# Altium project bme_affect_sen_brd.PrjPcb
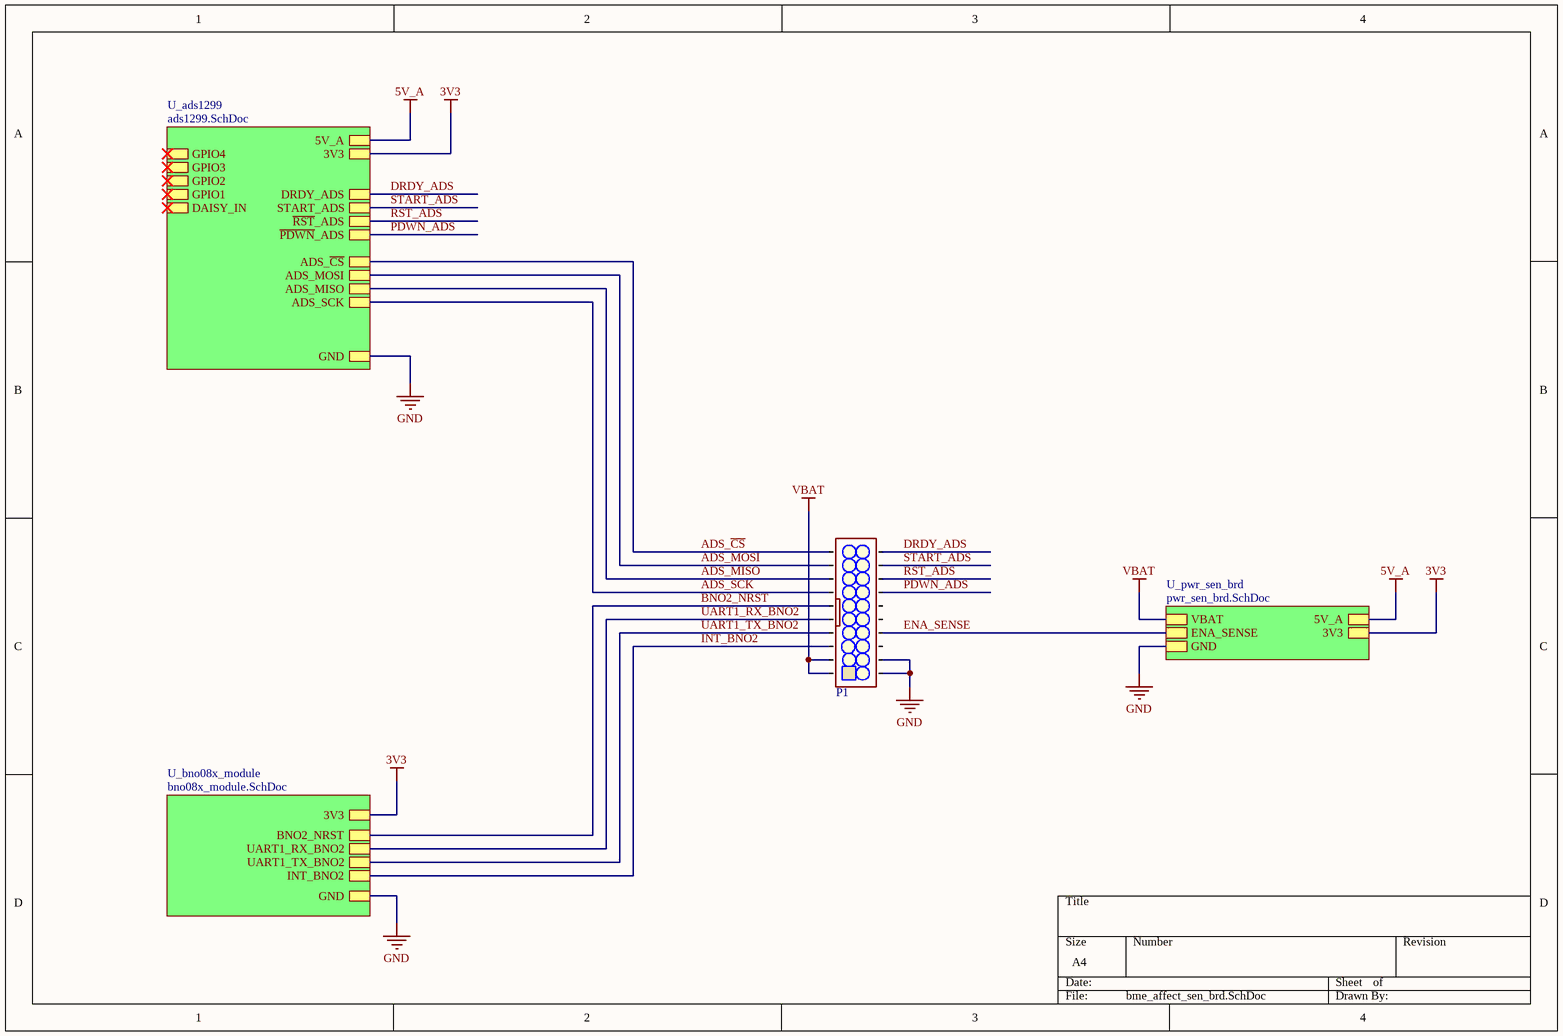
[diagram p0: bme_affect_sen_brd.SchDoc]
4 sheets, 139 parts. Net scope: hierarchical (ports join the sheet entries above them; power ports are global).
Board file: bme_affect_sen_brd.PcbDoc
Sheets:
  bme_affect_sen_brd.SchDoc
    U_ads1299 = ads1299.SchDoc
    U_pwr_sen_brd = pwr_sen_brd.SchDoc
    U_bno08x_module = bno08x_module.SchDoc

## Sheet bme_affect_sen_brd.SchDoc
size A4

### Parts
P1  2x10 Ribbon Header  [2x10_RIBBON_CABLE_CON]  (value not drawn)

### Sub-sheets
U_ads1299 = ads1299.SchDoc: DRDY_ADS, GPIO4, GPIO2, GPIO3, START_ADS, GPIO1, DAISY_IN, 3V3, 5V_A, GND, ~{RST}_ADS, ~{PDWN}_ADS, ADS_~{CS}, ADS_MOSI, ADS_MISO, ADS_SCK
U_bno08x_module = bno08x_module.SchDoc: 3V3, GND, BNO2_NRST, UART1_RX_BNO2, UART1_TX_BNO2, INT_BNO2
U_pwr_sen_brd = pwr_sen_brd.SchDoc: 5V_A, VBAT, GND, 3V3, ENA_SENSE

### Nets
3V3: sheet U_ads1299/3V3, sheet U_pwr_sen_brd/3V3, sheet U_bno08x_module/3V3
5V_A: sheet U_ads1299/5V_A, sheet U_pwr_sen_brd/5V_A
GND: P1.19 P1.20 ; sheet U_ads1299/GND, sheet U_pwr_sen_brd/GND, sheet U_bno08x_module/GND
VBAT: P1.1 P1.2 ; sheet U_pwr_sen_brd/VBAT
ADS_~{CS}: P1.10 ; sheet U_ads1299/ADS_~{CS}
ADS_MISO: P1.8 ; sheet U_ads1299/ADS_MISO
ADS_MOSI: P1.9 ; sheet U_ads1299/ADS_MOSI
ADS_SCK: P1.7 ; sheet U_ads1299/ADS_SCK
BNO2_NRST: P1.6 ; sheet U_bno08x_module/BNO2_NRST
DRDY_ADS: P1.11 ; sheet U_ads1299/DRDY_ADS
ENA_SENSE: P1.17 ; sheet U_pwr_sen_brd/ENA_SENSE
INT_BNO2: P1.3 ; sheet U_bno08x_module/INT_BNO2
~{PDWN}_ADS: P1.14 ; sheet U_ads1299/~{PDWN}_ADS
~{RST}_ADS: P1.13 ; sheet U_ads1299/~{RST}_ADS
START_ADS: P1.12 ; sheet U_ads1299/START_ADS
UART1_RX_BNO2: P1.5 ; sheet U_bno08x_module/UART1_RX_BNO2
UART1_TX_BNO2: P1.4 ; sheet U_bno08x_module/UART1_TX_BNO2

Not connected (* = marked no-connect by the designer): P1 15 16 18

### Library data of the parts
P1 = 2x10 Ribbon Header: 2.54 mm; Manufacturer Part No: 302-S201; Value: 2x10 Pin Header

## Sheet ads1299.SchDoc
size A3
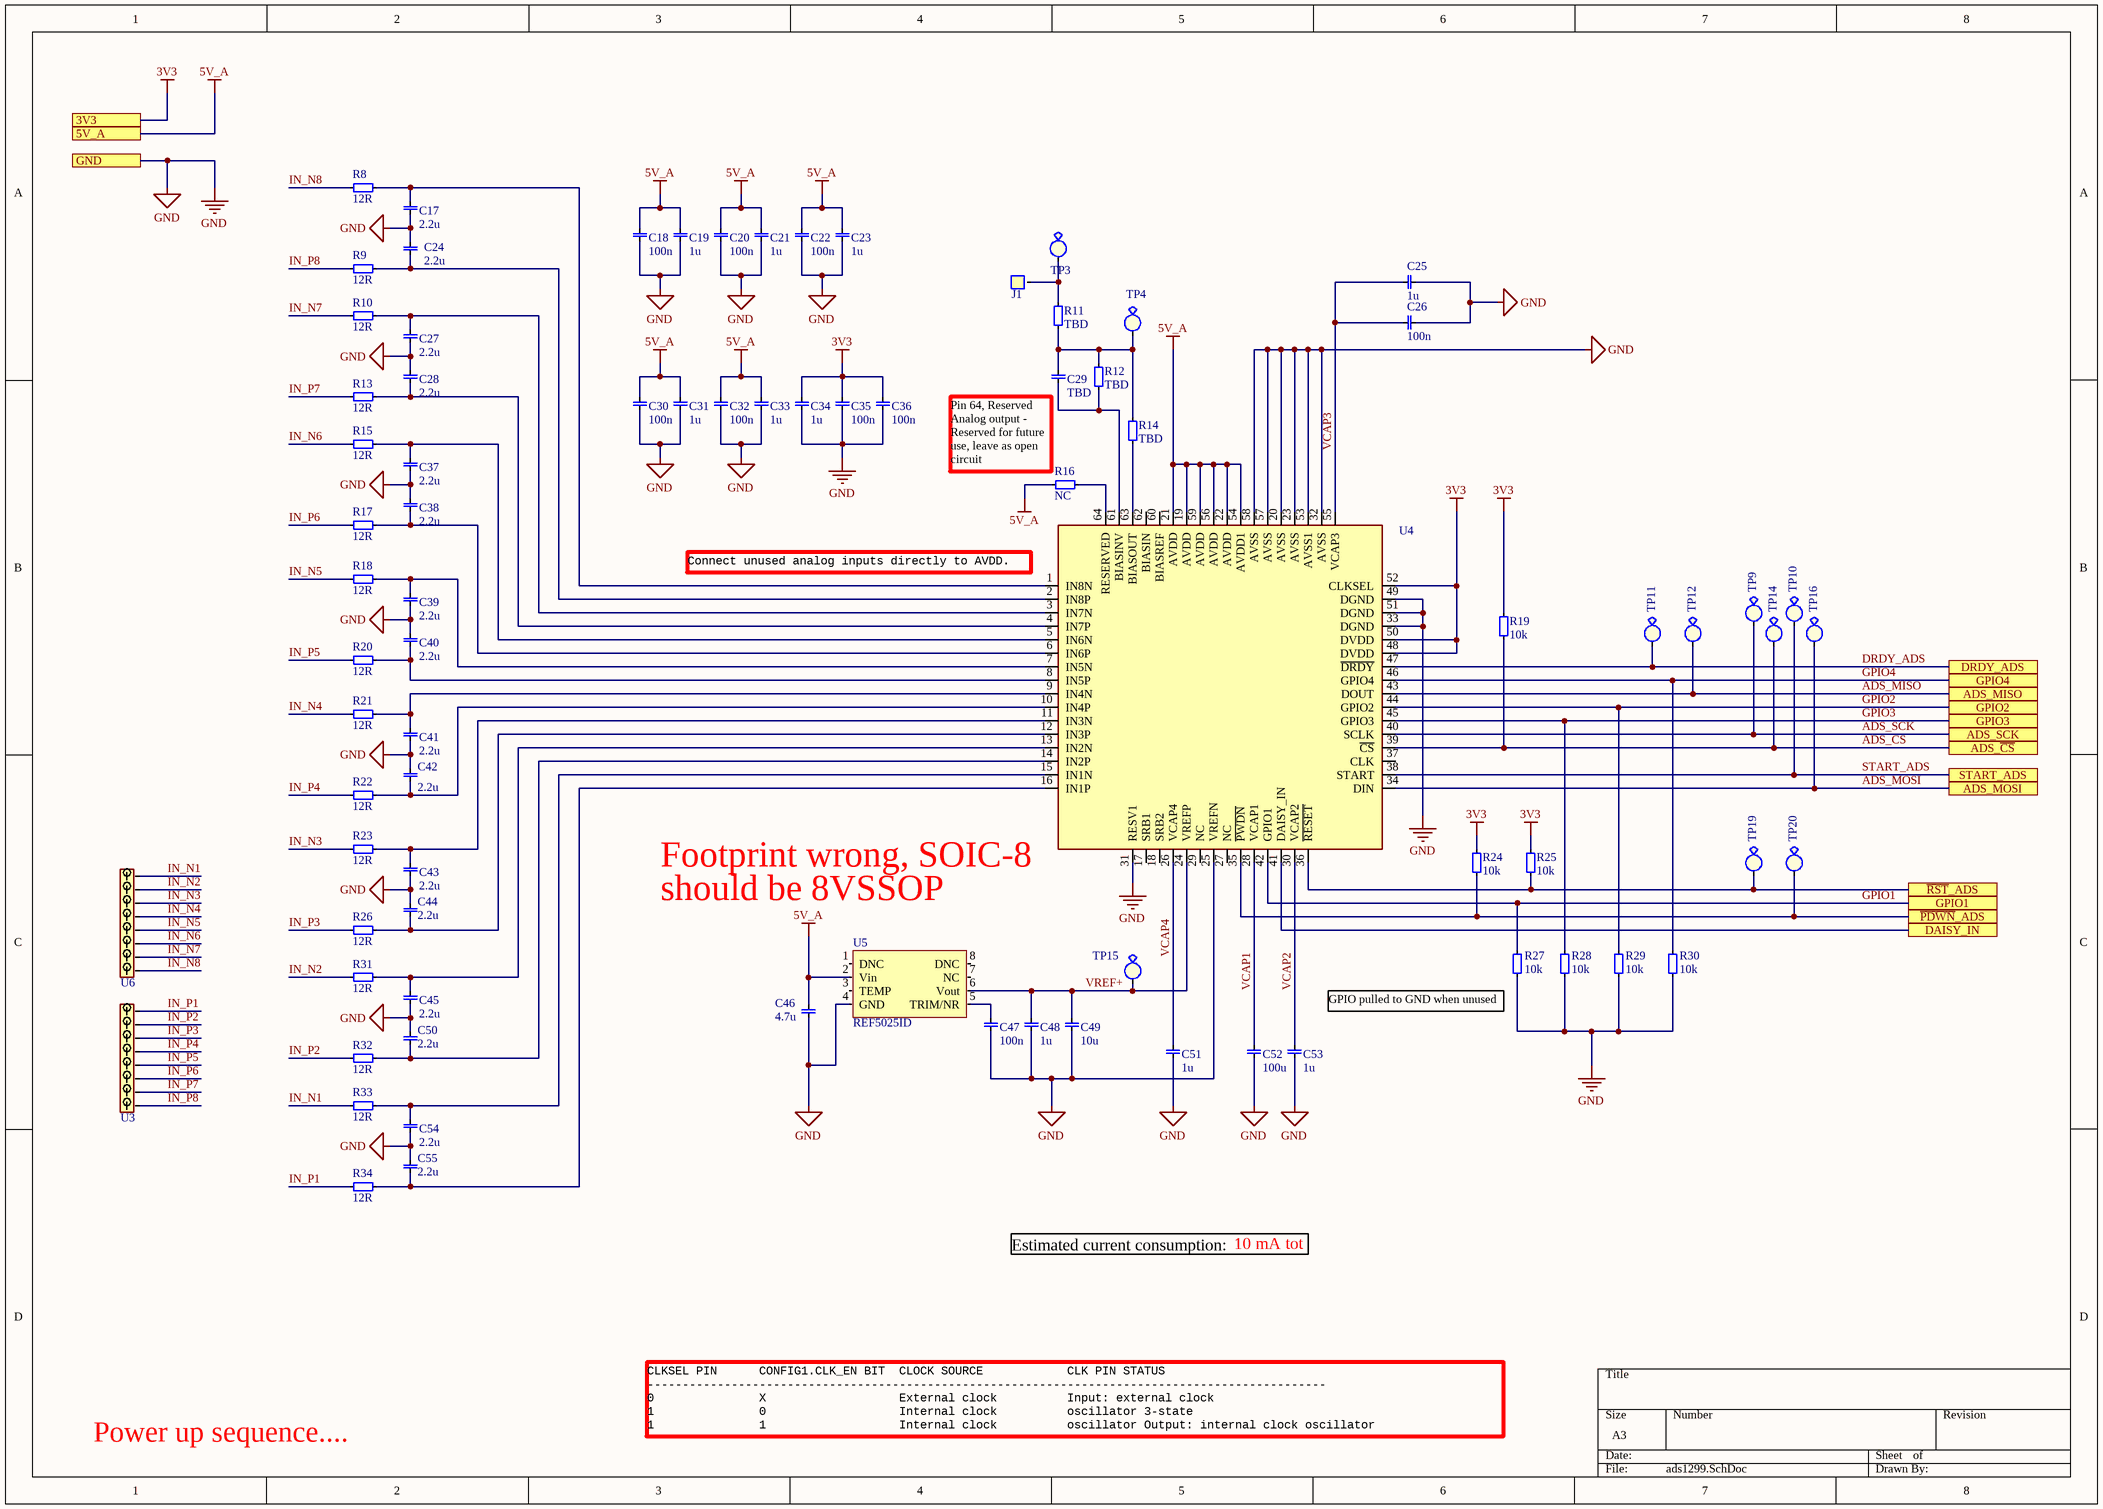
[diagram p1: ads1299.SchDoc]

### Parts
C17  value 2.2u  [0402 CAP]  (hidden comment: 0603, capacitor)
C18  value 100n  [0402 CAP]  (hidden comment: 0603, capacitor)
C19  value 1u  [0402 CAP]  (hidden comment: 0603, capacitor)
C20  value 100n  [0402 CAP]  (hidden comment: 0603, capacitor)
C21  value 1u  [0402 CAP]  (hidden comment: 0603, capacitor)
C22  value 100n  [0402 CAP]  (hidden comment: 0603, capacitor)
C23  value 1u  [0402 CAP]  (hidden comment: 0603, capacitor)
C24  value 2.2u  [0402 CAP]  (hidden comment: 0603, capacitor)
C25  value 1u  [0402 CAP]  (hidden comment: 0603, capacitor)
C26  value 100n  [0402 CAP]  (hidden comment: 0603, capacitor)
C27  value 2.2u  [0402 CAP]  (hidden comment: 0603, capacitor)
C28  value 2.2u  [0402 CAP]  (hidden comment: 0603, capacitor)
C29  value TBD  [0402 CAP]  (hidden comment: 0603, capacitor)
C30  value 100n  [0402 CAP]  (hidden comment: 0603, capacitor)
C31  value 1u  [0402 CAP]  (hidden comment: 0603, capacitor)
C32  value 100n  [0402 CAP]  (hidden comment: 0603, capacitor)
C33  value 1u  [0402 CAP]  (hidden comment: 0603, capacitor)
C34  value 1u  [0402 CAP]  (hidden comment: 0603, capacitor)
C35  value 100n  [0402 CAP]  (hidden comment: 0603, capacitor)
C36  value 100n  [0402 CAP]  (hidden comment: 0603, capacitor)
C37  value 2.2u  [0402 CAP]  (hidden comment: 0603, capacitor)
C38  value 2.2u  [0402 CAP]  (hidden comment: 0603, capacitor)
C39  value 2.2u  [0402 CAP]  (hidden comment: 0603, capacitor)
C40  value 2.2u  [0402 CAP]  (hidden comment: 0603, capacitor)
C41  value 2.2u  [0402 CAP]  (hidden comment: 0603, capacitor)
C42  value 2.2u  [0402 CAP]  (hidden comment: 0603, capacitor)
C43  value 2.2u  [0402 CAP]  (hidden comment: 0603, capacitor)
C44  value 2.2u  [0402 CAP]  (hidden comment: 0603, capacitor)
C45  value 2.2u  [0402 CAP]  (hidden comment: 0603, capacitor)
C46  value 4.7u  [0402 CAP]  (hidden comment: 0603, capacitor)
C47  value 100n  [0402 CAP]  (hidden comment: 0603, capacitor)
C48  value 1u  [0402 CAP]  (hidden comment: 0603, capacitor)
C49  value 10u  [0402 CAP]  (hidden comment: 0603, capacitor)
C50  value 2.2u  [0402 CAP]  (hidden comment: 0603, capacitor)
C51  value 1u  [0402 CAP]  (hidden comment: 0603, capacitor)
C52  value 100u  [1210, cap]  (hidden comment: 1210, capacitor)
C53  value 1u  [0402 CAP]  (hidden comment: 0603, capacitor)
C54  value 2.2u  [0402 CAP]  (hidden comment: 0603, capacitor)
C55  value 2.2u  [0402 CAP]  (hidden comment: 0603, capacitor)
J1  1x1 Mini binding post  [1_pin_binding_post]  (value not drawn)
R8  value 12R  [0402 res]  (hidden comment: 0603, resistor)
R9  value 12R  [0402 res]  (hidden comment: 0603, resistor)
R10  value 12R  [0402 res]  (hidden comment: 0603, resistor)
R11  value TBD  [0402 res]  (hidden comment: 0603, resistor)
R12  value TBD  [0402 res]  (hidden comment: 0603, resistor)
R13  value 12R  [0402 res]  (hidden comment: 0603, resistor)
R14  value TBD  [0402 res]  (hidden comment: 0603, resistor)
R15  value 12R  [0402 res]  (hidden comment: 0603, resistor)
R16  value NC  [0402 res]  (hidden comment: 0603, resistor)
R17  value 12R  [0402 res]  (hidden comment: 0603, resistor)
R18  value 12R  [0402 res]  (hidden comment: 0603, resistor)
R19  value 10k  [0402 res]  (hidden comment: 0603, resistor)
R20  value 12R  [0402 res]  (hidden comment: 0603, resistor)
R21  value 12R  [0402 res]  (hidden comment: 0603, resistor)
R22  value 12R  [0402 res]  (hidden comment: 0603, resistor)
R23  value 12R  [0402 res]  (hidden comment: 0603, resistor)
R24  value 10k  [0402 res]  (hidden comment: 0603, resistor)
R25  value 10k  [0402 res]  (hidden comment: 0603, resistor)
R26  value 12R  [0402 res]  (hidden comment: 0603, resistor)
R27  value 10k  [0402 res]  (hidden comment: 0603, resistor)
R28  value 10k  [0402 res]  (hidden comment: 0603, resistor)
R29  value 10k  [0402 res]  (hidden comment: 0603, resistor)
R30  value 10k  [0402 res]  (hidden comment: 0603, resistor)
R31  value 12R  [0402 res]  (hidden comment: 0603, resistor)
R32  value 12R  [0402 res]  (hidden comment: 0603, resistor)
R33  value 12R  [0402 res]  (hidden comment: 0603, resistor)
R34  value 12R  [0402 res]  (hidden comment: 0603, resistor)
TP3  Test Point  [TESTPOINT_SMD]  (value not drawn)
TP4  Test Point  [TESTPOINT_SMD]  (value not drawn)
TP9  Test Point  [TESTPOINT_SMD]  (value not drawn)
TP10  Test Point  [TESTPOINT_SMD]  (value not drawn)
TP11  Test Point  [TESTPOINT_SMD]  (value not drawn)
TP12  Test Point  [TESTPOINT_SMD]  (value not drawn)
TP14  Test Point  [TESTPOINT_SMD]  (value not drawn)
TP15  Test Point  [TESTPOINT_SMD]  (value not drawn)
TP16  Test Point  [TESTPOINT_SMD]  (value not drawn)
TP19  Test Point  [TESTPOINT_SMD]  (value not drawn)
TP20  Test Point  [TESTPOINT_SMD]  (value not drawn)
U3  1x8 Screw terminal  [screw_term_8_pos]  (value not drawn)
U4  ADS1299  [TQFP64_05MM_P]  (value not drawn)
U5  REF5025ID  [SOP65P490X110-8N]
U6  1x8 Screw terminal  [screw_term_8_pos]  (value not drawn)

### Ports
3V3, 5V_A, ADS_MISO, ADS_MOSI, ADS_SCK, ADS_~{CS}, DAISY_IN, DRDY_ADS, GND, GPIO1, GPIO2, GPIO3, GPIO4, START_ADS, ~{PDWN}_ADS, ~{RST}_ADS

### Nets
3V3: C34.1 C35.1 C36.1 R19.0 R24.0 R25.0 U4.48(DVDD) U4.50(DVDD) U4.52(CLKSEL) ; port 3V3
5V_A: C18.1 C19.1 C20.1 C21.1 C22.1 C23.1 C30.1 C31.1 C32.1 C33.1 C46.1 R16.0 U4.19(AVDD) U4.21(AVDD) U4.22(AVDD) U4.54(AVDD1) U4.56(AVDD) U4.59(AVDD) U5.2(Vin) ; port 5V_A
GND: C17.0 C18.0 C19.0 C20.0 C21.0 C22.0 C23.0 C24.0 C25.0 C26.0 C27.0 C28.0 C30.0 C31.0 C32.0 C33.0 C34.0 C35.0 C36.0 C37.0 C38.0 C39.0 C40.0 C41.0 C42.0 C43.0 C44.0 C45.0 C46.0 C47.0 C48.0 C49.0 C50.0 C51.0 C52.0 C53.0 C54.0 C55.0 R27.1 R28.1 R29.1 R30.1 U4.20(AVSS) U4.23(AVSS) U4.25(VREFN) U4.31(RESV1) U4.32(AVSS) U4.33(DGND) U4.49(DGND) U4.51(DGND) U4.53(AVSS1) U4.57(AVSS) U4.58(AVSS) U5.4(GND) ; port GND
ADS_~{CS}: R19.1 TP14.0 U4.39(~{CS}) ; port ADS_~{CS}
ADS_MISO: TP12.0 U4.43(DOUT) ; port ADS_MISO
ADS_MOSI: TP16.0 U4.34(DIN) ; port ADS_MOSI
ADS_SCK: TP9.0 U4.40(SCLK) ; port ADS_SCK
DRDY_ADS: TP11.0 U4.47(~{DRDY}) ; port DRDY_ADS
GPIO1: R27.0 U4.42(GPIO1) ; port GPIO1
GPIO2: R29.0 U4.44(GPIO2) ; port GPIO2
GPIO3: R28.0 U4.45(GPIO3) ; port GPIO3
GPIO4: R30.0 U4.46(GPIO4) ; port GPIO4
IN_N1: R33.1 U6.1
IN_N2: R31.1 U6.2
IN_N3: R23.1 U6.3
IN_N4: R21.1 U6.4
IN_N5: R18.1 U6.5
IN_N6: R15.1 U6.6
IN_N7: R10.1 U6.7
IN_N8: R8.1 U6.8
IN_P1: R34.1 U3.8
IN_P2: R32.1 U3.7
IN_P3: R26.1 U3.6
IN_P4: R22.1 U3.5
IN_P5: R20.1 U3.4
IN_P6: R17.1 U3.3
IN_P7: R13.1 U3.2
IN_P8: R9.1 U3.1
~{PDWN}_ADS: R24.1 TP20.0 U4.35(~{PWDN}) ; port ~{PDWN}_ADS
~{RST}_ADS: R25.1 TP19.0 U4.36(~{RESET}) ; port ~{RST}_ADS
START_ADS: TP10.0 U4.38(START) ; port START_ADS
VCAP1: C52.1 U4.28(VCAP1)
VCAP2: C53.1 U4.30(VCAP2)
VCAP3: C25.1 C26.1 U4.55(VCAP3)
VCAP4: C51.1 U4.26(VCAP4)
VREF+: C48.1 C49.1 TP15.0 U4.24(VREFP) U5.6(Vout)
NetC17_1: C17.1 R8.0 U4.1(IN8N)
NetC24_1: C24.1 R9.0 U4.2(IN8P)
NetC27_1: C27.1 R10.0 U4.3(IN7N)
NetC28_1: C28.1 R13.0 U4.4(IN7P)
NetC29_0: C29.0 R12.1 U4.61(BIASINV)
NetC29_1: C29.1 R11.1 R12.0 R14.0 TP4.0
NetC37_1: C37.1 R15.0 U4.5(IN6N)
NetC38_1: C38.1 R17.0 U4.6(IN6P)
NetC39_1: C39.1 R18.0 U4.7(IN5N)
NetC40_1: C40.1 R20.0 U4.8(IN5P)
NetC41_1: C41.1 R21.0 U4.9(IN4N)
NetC42_1: C42.1 R22.0 U4.10(IN4P)
NetC43_1: C43.1 R23.0 U4.11(IN3N)
NetC44_1: C44.1 R26.0 U4.12(IN3P)
NetC45_1: C45.1 R31.0 U4.13(IN2N)
NetC47_1: C47.1 U5.5(TRIM/NR)
NetC50_1: C50.1 R32.0 U4.14(IN2P)
NetC54_1: C54.1 R33.0 U4.15(IN1N)
NetC55_1: C55.1 R34.0 U4.16(IN1P)
NetJ1_1: J1.1 R11.0 TP3.0
NetR14_1: R14.1 U4.63(BIASOUT)
NetR16_1: R16.1 U4.64(RESERVED)
NetU4_41: U4.41(DAISY_IN) ; port DAISY_IN

Not connected (* = marked no-connect by the designer): U4 17(SRB1) 18(SRB2) 27(NC) 29(NC) 37(CLK) 60(BIASREF) 62(BIASIN); U5 1(DNC) 3(TEMP) 7(NC) 8(DNC)

### Notes on the sheet
- Pin 64, Reserved Analog output - Reserved for future use, leave as open circuit
- (near U4) Connect unused analog inputs directly to AVDD.
- (near U4) Footprint wrong, SOIC-8
- should be 8VSSOP
- (near R27) GPIO pulled to GND when unused
- Estimated current consumption:
- 10 mA tot
- Power up sequence....
- CLKSEL PIN      CONFIG1.CLK_EN BIT  CLOCK SOURCE            CLK PIN STATUS
  -------------------------------------------------------------------------------------------------
  0               X                   External clock          Input: external clock
  1               0                   Internal clock          oscillator 3-state
  1               1                   Internal clock          oscillator Output: internal clock oscillator

### Library data of the parts
C17 C24 C27 C28 C37-C45 C50 C54 C55 = 0603, capacitor: Manufacturer Part No: GRM155D71A225ME15D
C18 C20 C22 C26 C30 C32 C35 C36 C47 = 0603, capacitor: Manufacturer Part No: GRM155R62A104KE14D
C19 C21 C23 C25 C31 C33 C34 C48 C51 C53 = 0603, capacitor: Manufacturer Part No: CL05A105KO5NNNC
C46 = 0603, capacitor: Manufacturer Part No: 04023U4R7CAT2A
C49 = 0603, capacitor: Manufacturer Part No: GRM155R61A106ME11D
C52 = 1210, capacitor: Manufacturer Part No: EMK325ABJ107MM-T
J1 = 1x1 Mini binding post: 1 Pin Binding Post M2.5 Through Hole; Manufacturer Part No: 8730; Value: 1x3 Pin Header
R8-R10 R13 R15 R17 R18 R20-R23 R26 R31-R34 = 0603, resistor: Manufacturer Part No: RC0402FR-0712RL
R19 R24 R25 R27-R30 = 0603, resistor: Manufacturer Part No: 311-10.0KLRCT-ND
U3 U6 = 1x8 Screw terminal: Manufacturer Part No: OSTVN08A150
U4 = ADS1299: 24-Bit, Analog-to-Digital Converter for EEG and / Biopotential Measurements; Manufacturer Part No: ADS1299IPAG
TP3 TP4 TP9-TP12 TP14-TP16 TP19 TP20 = Test Point: Value: Test point; Farnell: 1702006
U5 = REF5025ID: Value: REF5025ID; Farnell: 1702829; Manufacturer Part No: REF5025ID

## Sheet pwr_sen_brd.SchDoc
size A4
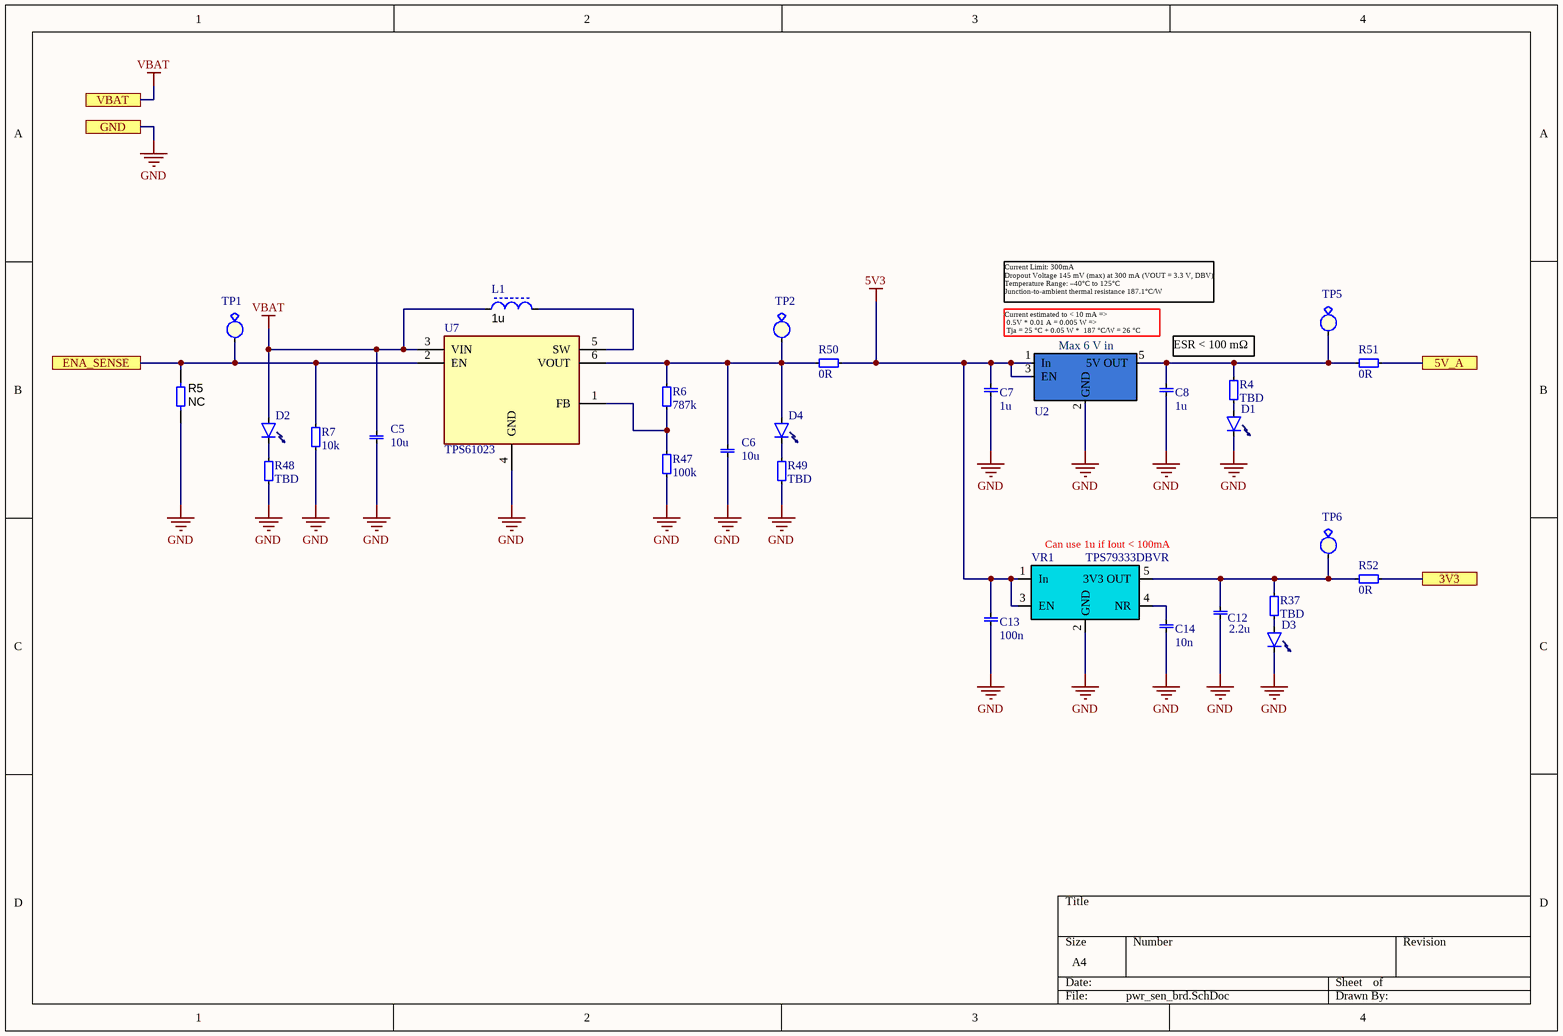
[diagram p2: pwr_sen_brd.SchDoc]

### Parts
C5  value 10u  [1206, capasitor]  (hidden comment: 1206, capacitor)
C6  value 10u  [1206, capasitor]  (hidden comment: 1206, capacitor)
C7  value 1u  [0402 CAP]  (hidden comment: 0603, capacitor)
C8  value 1u  [0402 CAP]  (hidden comment: 0603, capacitor)
C12  value 2.2u  [0402 CAP]  (hidden comment: 0603, capacitor)
C13  value 100n  [0402 CAP]  (hidden comment: 0603, capacitor)
C14  value 10n  [0603 cap]  (hidden comment: 0603, capacitor)
D1  0603, LED  [0603 LED]  (value not drawn)
D2  0603, LED  [0603 LED]  (value not drawn)
D3  0603, LED  [0603 LED]  (value not drawn)
D4  0603, LED  [0603 LED]  (value not drawn)
L1  value 1u  [74404043010A]  (hidden comment: Inductor, 74404043010A)
R4  value TBD  [0402 res]  (hidden comment: 0603, resistor)
R5  value NC  [0603]  (hidden comment: RES, 0603)
R6  value 787k  [0402 res]  (hidden comment: 0603, resistor)
R7  value 10k  [0402 res]  (hidden comment: 0603, resistor)
R37  value TBD  [0402 res]  (hidden comment: 0603, resistor)
R47  value 100k  [0402 res]  (hidden comment: 0603, resistor)
R48  value TBD  [0402 res]  (hidden comment: 0603, resistor)
R49  value TBD  [0402 res]  (hidden comment: 0603, resistor)
R50  value 0R  [0603]  (hidden comment: 0603, resistor)
R51  value 0R  [0603]  (hidden comment: 0603, resistor)
R52  value 0R  [0603]  (hidden comment: 0603, resistor)
TP1  Test Point  [TESTPOINT_SMD]  (value not drawn)
TP2  Test Point  [TESTPOINT_SMD]  (value not drawn)
TP5  Test Point  [TESTPOINT_SMD]  (value not drawn)
TP6  Test Point  [TESTPOINT_SMD]  (value not drawn)
U2  TPS7A20  [SOT23-5]  (value not drawn)
U7  TPS61023  [SOT50P160X60-6N]
VR1  TPS79333DBVR  [SOT23-5]

### Ports
3V3, 5V_A, ENA_SENSE, GND, VBAT

### Nets
3V3: R52.0 ; port 3V3
5V3: C7.1 C13.1 R50.0 U2.1(In) U2.3(EN) VR1.1(In) VR1.3(EN)
5V_A: R51.0 ; port 5V_A
GND: C5.0 C6.0 C7.0 C8.0 C12.0 C13.0 C14.0 D1.0(Cathode) D3.0(Cathode) R5.1 R7.1 R47.1 R48.1 R49.1 U2.2(GND) U7.4(GND) VR1.2(GND) ; port GND
VBAT: C5.1 D2.1 L1.2 U7.3(VIN) ; port VBAT
ENA_SENSE: R5.2 R7.0 TP1.0 U7.2(EN) ; port ENA_SENSE
NetC6_1: C6.1 D4.1 R6.0 R50.1 TP2.0 U7.6(VOUT)
NetC8_1: C8.1 R4.1 R51.1 TP5.0 U2.5(5V_OUT)
NetC12_1: C12.1 R37.1 R52.1 TP6.0 VR1.5(3V3_OUT)
NetC14_1: C14.1 VR1.4(NR)
NetD1_1: D1.1 R4.0
NetD2_0: D2.0(Cathode) R48.0
NetD3_1: D3.1 R37.0
NetD4_0: D4.0(Cathode) R49.0
NetL1_1: L1.1 U7.5(SW)
NetR6_1: R6.1 R47.0 U7.1(FB)

### Notes on the sheet
- Current Limit: 300mA
  Dropout Voltage 145 mV (max) at 300 mA (VOUT = 3.3 V, DBV)
  Temperature Range: –40°C to 125°C
  Junction-to-ambient thermal resistance 187.1°C/W
- (near U2) Current estimated to < 10 mA =>
  0.5V * 0.01 A = 0.005 W =>
  Tja = 25 °C + 0.05 W *  187 °C/W = 26 °C
- ESR < 100 mΩ
- (near VR1) Can use 1u if Iout < 100mA
- (in symbol TPS7A20) Max 6 V in

### Library data of the parts
C5 C6 = 1206, capacitor: GRM155R61A106ME11D; Manufacturer Part No: CL31A106KAHNNNE
C7 C8 = 0603, capacitor: Manufacturer Part No: CL05A105KO5NNNC
C12 = 0603, capacitor: Manufacturer Part No: GRM155D71A225ME15D
C13 = 0603, capacitor: Manufacturer Part No: GRM155R62A104KE14D
C14 = 0603, capacitor: Manufacturer Part No: CL10B103KB8NNNC
D1 D3 = 0603, LED: Manufacturer Part No: 150060SS75003
D2 D4 = 0603, LED: Manufacturer Part No: 5988081107F
L1 = Inductor, 74404043010A: Shielded Power Inductor with Ferrite Core; SRF: 167 MHz; DC Resistance: 14 mOhm; PartNumber: 74404043010A; Manufacturer Part No: 74404043010A
R6 = 0603, resistor: RES 787K OHM 1% 1/16W 0402; Manufacturer Part No: RC0402FR-07787KL
R7 = 0603, resistor: Manufacturer Part No: 311-10.0KLRCT-ND
R47 = 0603, resistor: Manufacturer Part No: RC0402FR-07100KL
R50-R52 = 0603, resistor: Manufacturer Part No: CRCW06030000Z0EA
U2 = TPS7A20: 5V and 300-mA, Ultra-Low-Noise, Low-IQ, High PSRR LDO; Manufacturer Part No: TPS7A2050PDBVR
U7 = TPS61023: TPS61023 3.7-A Boost Converter with 0.5-V Ultra-low Input Voltage; Manufacturer Part No: TPS61023DRLT; Order code: 595-TPS61023DRLT; Cost (kr): 12,54; Supplier: Mouser
VR1 = TPS79333DBVR: Low Dropout Regulators(LDO) Positive Fixed 180mV @ 200mA 5.5V 3.3V 200mA SOT-23-5 RoHS; Dropout Voltage: 102mV; Manufacturer Part No: TPS79333DBVR
R5 = RES, 0603: ComponentLink1Description: Datasheet link; ComponentLink1URL: http://www.vishay.com/docs/28705/mcx0x0xpro.pdf
TP1 TP2 TP5 TP6 = Test Point: Value: Test point; Farnell: 1702006

## Sheet bno08x_module.SchDoc
size A4; SheetNumber: 1; SheetTotal: 1
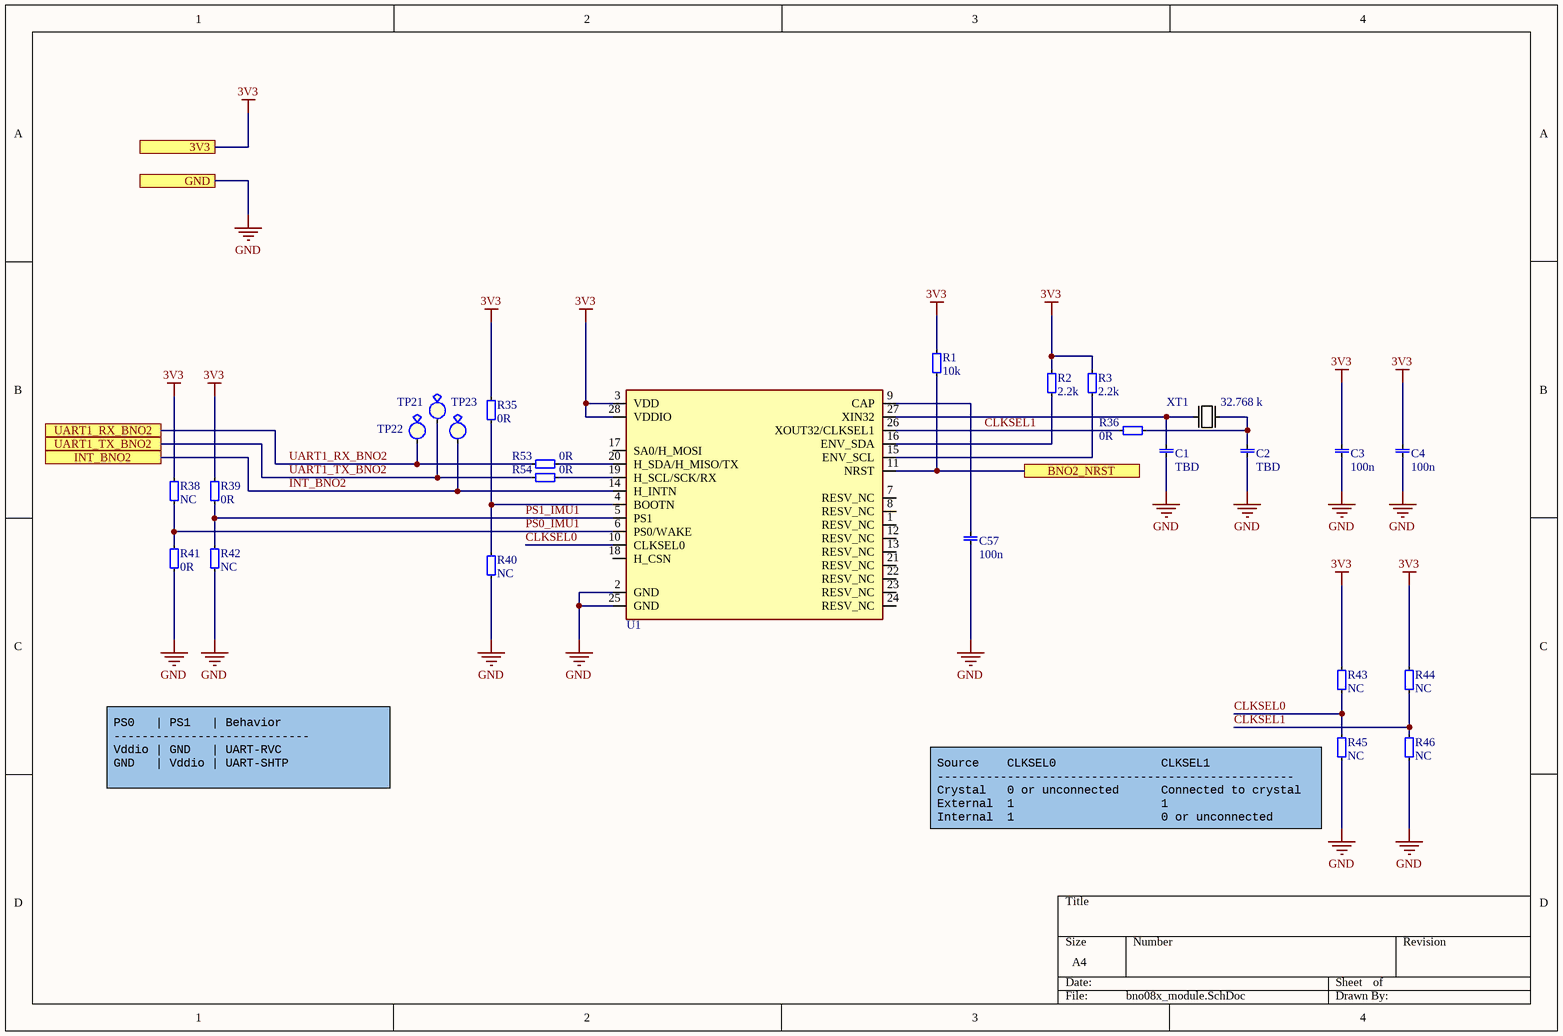
[diagram p3: bno08x_module.SchDoc]

### Parts
C1  value TBD  [0402 CAP]  (hidden comment: 0402 capacitor)
C2  value TBD  [0402 CAP]  (hidden comment: 0402 capacitor)
C3  value 100n  [0402 CAP]  (hidden comment: 0402 capacitor)
C4  value 100n  [0402 CAP]  (hidden comment: 0402 capacitor)
C57  value 100n  [0402 CAP]  (hidden comment: 0402 capacitor)
R1  value 10k  [0402 res]  (hidden comment: 0402, resistor)
R2  value 2.2k  [0402 res]  (hidden comment: 0402, resistor)
R3  value 2.2k  [0402 res]  (hidden comment: 0402, resistor)
R35  value 0R  [0402 res]  (hidden comment: 0402, resistor)
R36  value 0R  [0402 res]  (hidden comment: 0402, resistor)
R38  value NC  [0402 res]  (hidden comment: 0402, resistor)
R39  value 0R  [0402 res]  (hidden comment: 0402, resistor)
R40  value NC  [0402 res]  (hidden comment: 0402, resistor)
R41  value 0R  [0402 res]  (hidden comment: 0402, resistor)
R42  value NC  [0402 res]  (hidden comment: 0402, resistor)
R43  value NC  [0402 res]  (hidden comment: 0402, resistor)
R44  value NC  [0402 res]  (hidden comment: 0402, resistor)
R45  value NC  [0402 res]  (hidden comment: 0402, resistor)
R46  value NC  [0402 res]  (hidden comment: 0402, resistor)
R53  value 0R  [0402 res]  (hidden comment: 0402, resistor)
R54  value 0R  [0402 res]  (hidden comment: 0402, resistor)
TP21  Test Point  [TESTPOINT_SMD]  (value not drawn)
TP22  Test Point  [TESTPOINT_SMD]  (value not drawn)
TP23  Test Point  [TESTPOINT_SMD]  (value not drawn)
U1  BNO08X  [LGA-28_2]  (value not drawn)
XT1  value 32.768 k  [ECS-.327-12.5-39-TR]  (hidden comment: Crystal)

### Ports
3V3, BNO2_NRST, GND, INT_BNO2, UART1_RX_BNO2, UART1_TX_BNO2

### Nets
3V3: C3.1 C4.1 R1.1 R2.1 R3.1 R35.1 R38.0 R39.0 R43.0 R44.0 U1.3(VDD) U1.28(VDDIO) ; port 3V3
GND: C1.0 C2.0 C3.0 C4.0 C57.0 R40.1 R41.1 R42.1 R45.1 R46.1 U1.2(GND) U1.25(GND) ; port GND
BNO2_NRST: R1.0 U1.11(NRST) ; port BNO2_NRST
CLKSEL0: R43.1 R45.0 U1.10(CLKSEL0)
CLKSEL1: R36.0 R44.1 R46.0 U1.26(XOUT32/CLKSEL1)
INT_BNO2: TP23.0 U1.14(H_INTN) ; port INT_BNO2
PS0_IMU1: R38.1 R41.0 U1.6(PS0/WAKE)
PS1_IMU1: R39.1 R42.0 U1.5(PS1)
UART1_RX_BNO2: R53.1 TP22.0 ; port UART1_RX_BNO2
UART1_TX_BNO2: R54.1 TP21.0 ; port UART1_TX_BNO2
NetC1_1: C1.1 U1.27(XIN32) XT1.1
NetC2_1: C2.1 R36.1 XT1.2
NetC57_1: C57.1 U1.9(CAP)
NetR2_0: R2.0 U1.16(ENV_SDA)
NetR3_0: R3.0 U1.15(ENV_SCL)
NetR35_0: R35.0 R40.0 U1.4(BOOTN)
NetR53_0: R53.0 U1.20(H_SDA/H_MISO/TX)
NetR54_0: R54.0 U1.19(H_SCL/SCK/RX)

Not connected (* = marked no-connect by the designer): U1 1(RESV_NC) 7(RESV_NC) 8(RESV_NC) 12(RESV_NC) 13(RESV_NC) 17(SA0/H_MOSI) 18(H_CSN) 21(RESV_NC) 22(RESV_NC) 23(RESV_NC) 24(RESV_NC)

### Notes on the sheet
- PS0   | PS1   | Behavior
  ----------------------------
  Vddio | GND   | UART-RVC
  GND   | Vddio | UART-SHTP
- (near R45) Source    CLKSEL0               CLKSEL1
  ---------------------------------------------------
  Crystal   0 or unconnected      Connected to crystal
  External  1                     1
  Internal  1                     0 or unconnected

### Library data of the parts
C3 C4 C57 = 0402 capacitor: Manufacturer Part No: GRM155R62A104KE14D
R1 = 0402, resistor: Manufacturer Part No: 311-10.0KLRCT-ND
R2 R3 = 0402, resistor: Manufacturer Part No: RC0402FR-072K2L
R35 R36 R39 R41 R53 R54 = 0402, resistor: Manufacturer Part No: RMCF0402ZT0R00
U1 = BNO08X: 9-axis IMU; Manufacturer Part No: BNO085
XT1 = Crystal: Manufacturer Part No: CC4V-T1A-32.768KHZ-9PF-20PPM-TA-QC
TP21-TP23 = Test Point: Value: Test point; Farnell: 1702006

## Nets that join several sheets
3V3: ads1299 (9 pins), pwr_sen_brd (R52.0), bno08x_module (12 pins)
5V_A: ads1299 (19 pins), pwr_sen_brd (R51.0)
GND: bme_affect_sen_brd (P1.19 P1.20), ads1299 (54 pins), pwr_sen_brd (17 pins), bno08x_module (12 pins)
VBAT: bme_affect_sen_brd (P1.1 P1.2), pwr_sen_brd (C5.1 D2.1 L1.2 U7.3)
ADS_~{CS}: bme_affect_sen_brd (P1.10), ads1299 (R19.1 TP14.0 U4.39)
ADS_MISO: bme_affect_sen_brd (P1.8), ads1299 (TP12.0 U4.43)
ADS_MOSI: bme_affect_sen_brd (P1.9), ads1299 (TP16.0 U4.34)
ADS_SCK: bme_affect_sen_brd (P1.7), ads1299 (TP9.0 U4.40)
BNO2_NRST: bme_affect_sen_brd (P1.6), bno08x_module (R1.0 U1.11)
DRDY_ADS: bme_affect_sen_brd (P1.11), ads1299 (TP11.0 U4.47)
ENA_SENSE: bme_affect_sen_brd (P1.17), pwr_sen_brd (R5.2 R7.0 TP1.0 U7.2)
INT_BNO2: bme_affect_sen_brd (P1.3), bno08x_module (TP23.0 U1.14)
~{PDWN}_ADS: bme_affect_sen_brd (P1.14), ads1299 (R24.1 TP20.0 U4.35)
~{RST}_ADS: bme_affect_sen_brd (P1.13), ads1299 (R25.1 TP19.0 U4.36)
START_ADS: bme_affect_sen_brd (P1.12), ads1299 (TP10.0 U4.38)
UART1_RX_BNO2: bme_affect_sen_brd (P1.5), bno08x_module (R53.1 TP22.0)
UART1_TX_BNO2: bme_affect_sen_brd (P1.4), bno08x_module (R54.1 TP21.0)